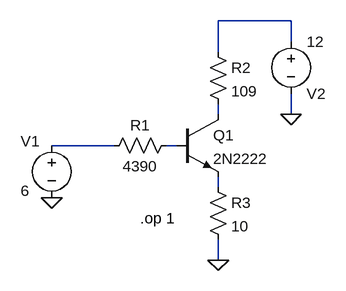
[diagram p0: schematic npn1.asc]
npn1.asc, the LTspice schematic file:
Version 4
SHEET 1 880 680
WIRE 288 80 176 80
WIRE 288 112 288 80
WIRE 176 128 176 80
WIRE 176 224 176 208
WIRE 288 224 288 192
WIRE 16 272 -80 272
WIRE 112 272 96 272
WIRE 176 336 176 320
WIRE 176 448 176 416
FLAG 176 448 0
FLAG -80 352 0
FLAG 288 224 0
SYMBOL voltage -80 256 R0
WINDOW 0 -33 25 Bottom 2
WINDOW 3 -41 70 Top 2
WINDOW 123 0 0 Left 0
WINDOW 39 0 0 Left 0
SYMATTR InstName V1
SYMATTR Value 6
SYMBOL voltage 288 96 R0
WINDOW 0 24 96 Left 2
WINDOW 3 24 16 Left 2
WINDOW 123 0 0 Left 0
WINDOW 39 0 0 Left 0
SYMATTR InstName V2
SYMATTR Value 12
SYMBOL res 112 256 R90
WINDOW 0 0 56 VBottom 2
WINDOW 3 32 56 VTop 2
SYMATTR InstName R1
SYMATTR Value 4390
SYMBOL res 160 112 R0
SYMATTR InstName R2
SYMATTR Value 109
SYMBOL res 160 320 R0
SYMATTR InstName R3
SYMATTR Value 10
SYMBOL npn 112 224 R0
SYMATTR InstName Q1
SYMATTR Value 2N2222
TEXT 56 384 Left 2 !.op 1

The netlist it stands for:
* npn1.asc
V1 N003 0 6
V2 N001 0 12
R1 N004 N003 4390
R2 N001 N002 109
R3 N005 0 10
Q1 N002 N004 N005 0 2N2222
.model NPN NPN
.model PNP PNP
.lib standard.bjt
.op 1
.backanno
.end